# EAGLE design ChassisCab-samd21g (EAGLE 8.1.0)
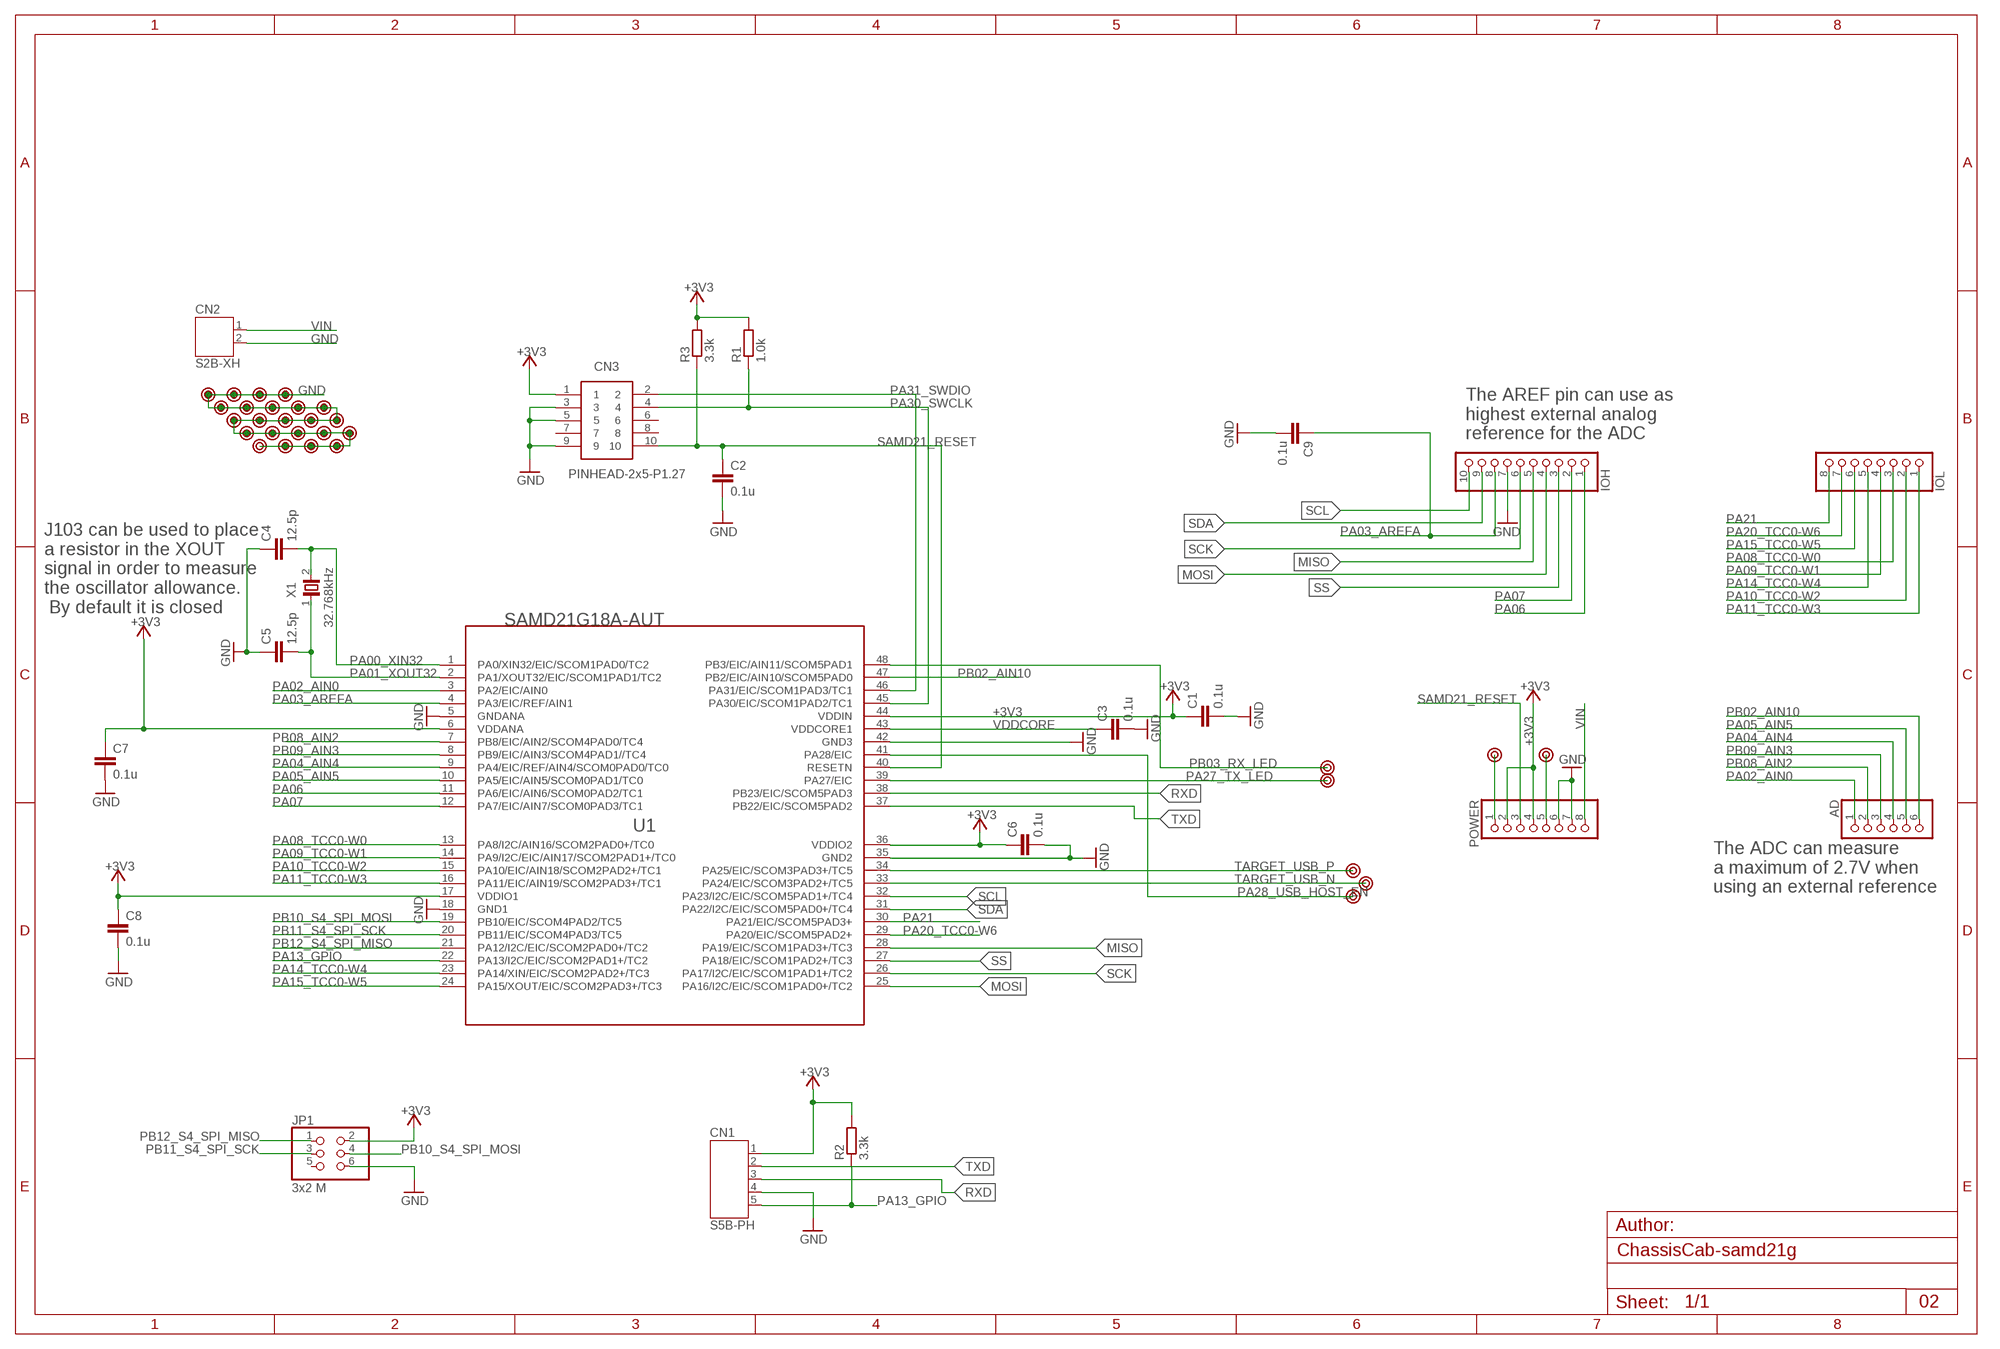
[diagram p0: schematic, sheet 1]

## Parts
AD  6x1F-H8.5  PINHD-1X6  [1X06]
C1  0.1u  C-EUC0603  [C0603]
C2  0.1u  C-EUC0603  [C0603]
C3  0.1u  C-EUC0603  [C0603]
C4  12.5p  C-EUC0603  [C0603]
C5  12.5p  C-EUC0603  [C0603]
C6  0.1u  C-EUC0603  [C0603]
C7  0.1u  C-EUC0603  [C0603]
C8  0.1u  C-EUC0603  [C0603]
C9  0.1u  C-EUC0603  [C0603]
CN1  S5B-PH  [S5B-PH]
CN2  S2B-XH  [S2B-XH]
CN3  PINHEAD-2x5-P1.27  SHF-105-01-X-D-SM  [SHF-105-01-X-D-SM]
IOH  10x1F-H8.5  PINHD-1X10_ARD  [1X10]
IOL  8x1F-H8.5  PINHD-1X8  [1X08]
JP1  3x2 M  PINHD-2X3  [2X03]
POWER  8x1F-H8.5  PINHD-1X8  [1X08]
R1  1.0k  R-EU_R0603  [R0603]
R2  3.3k  R-EU_R0603  [R0603]
R3  3.3k  R-EU_R0603  [R0603]
U1  SAMD21G18A-AUT  SAMD21G18A  [TQFP48]
U$1  PAD  [PAD]
U$2  PAD  [PAD]
U$3  PAD  [PAD]
U$4  PAD  [PAD]
U$6  PAD  [PAD]
U$7  PAD  [PAD]
U$8  PAD  [PAD]
U$9  PAD  [PAD]
U$10  PAD  [PAD]
U$11  PAD  [PAD]
U$12  PAD  [PAD]
U$13  PAD  [PAD]
U$14  PAD  [PAD]
U$15  PAD  [PAD]
U$16  PAD  [PAD]
U$17  PAD  [PAD]
U$18  PAD  [PAD]
U$19  PAD  [PAD]
U$20  PAD  [PAD]
U$21  PAD  [PAD]
U$22  PAD  [PAD]
U$23  PAD  [PAD]
U$24  PAD  [PAD]
U$25  PAD  [PAD]
U$26  PAD  [PAD]
U$27  PAD  [PAD]
U$28  PAD  [PAD]
U$29  PAD  [PAD]
U$30  PAD  [PAD]
U$31  PAD  [PAD]
X1  32.768kHz  FC-135  [FC-135]

## Nets
+3V3: C1.1 C6.1 C7.1 C8.1 CN1.1 CN3.1 JP1.2 POWER.2 POWER.4 R1.2 R2.2 R3.2 U1.6(VDDANA) U1.17(VDDIO1) U1.36(VDDIO2) U1.44(VDDIN)
GND [gnd]: C1.2 C2.2 C3.2 C4.1 C5.1 C6.2 C7.2 C8.2 C9.2 CN1.4 CN2.2 CN3.3 CN3.5 CN3.9 IOH.7 JP1.6 POWER.6 POWER.7 U1.5(GNDANA) U1.18(GND1) U1.35(GND2) U1.42(GND3) U$2.1 U$8.1 U$9.1 U$10.1 U$11.1 U$12.1 U$13.1 U$14.1 U$15.1 U$16.1 U$17.1 U$18.1 U$19.1 U$20.1 U$21.1 U$22.1 U$23.1 U$24.1 U$25.1 U$26.1 U$27.1 U$28.1 U$31.1
MISO: IOH.5 U1.28(PA19/EIC/SCOM1PAD3+/TC3)
MOSI: IOH.4 U1.25(PA16/I2C/EIC/SCOM1PAD0+/TC2)
N$1: POWER.1 U$29.1
N$2: POWER.5 U$30.1
PA00_XIN32: C4.2 U1.1(PA0/XIN32/EIC/SCOM1PAD0/TC2) X1.2
PA01_XOUT32: C5.2 U1.2(PA1/XOUT32/EIC/SCOM1PAD1/TC2) X1.1
PA02_AIN0: AD.1 U1.3(PA2/EIC/AIN0)
PA03_AREFA: C9.1 IOH.8 U1.4(PA3/EIC/REF/AIN1)
PA04_AIN4: AD.4 U1.9(PA4/EIC/REF/AIN4/SCOM0PAD0/TC0)
PA05_AIN5: AD.5 U1.10(PA5/EIC/AIN5/SCOM0PAD1/TC0)
PA06: IOH.1 U1.11(PA6/EIC/AIN6/SCOM0PAD2/TC1)
PA07: IOH.2 U1.12(PA7/EIC/AIN7/SCOM0PAD3/TC1)
PA08_TCC0-W0: IOL.3 U1.13(PA8/I2C/AIN16/SCOM2PAD0+/TC0)
PA09_TCC0-W1: IOL.4 U1.14(PA9/I2C/EIC/AIN17/SCOM2PAD1+/TC0)
PA10_TCC0-W2: IOL.2 U1.15(PA10/EIC/AIN18/SCOM2PAD2+/TC1)
PA11_TCC0-W3: IOL.1 U1.16(PA11/EIC/AIN19/SCOM2PAD3+/TC1)
PA13_GPIO: CN1.5 R2.1 U1.22(PA13/I2C/EIC/SCOM2PAD1+/TC2)
PA14_TCC0-W4: IOL.5 U1.23(PA14/XIN/EIC/SCOM2PAD2+/TC3)
PA15_TCC0-W5: IOL.6 U1.24(PA15/XOUT/EIC/SCOM2PAD3+/TC3)
PA20_TCC0-W6: IOL.7 U1.29(PA20/EIC/SCOM5PAD2+)
PA21: IOL.8 U1.30(PA21/EIC/SCOM5PAD3+)
PA27_TX_LED: U1.39(PA27/EIC) U$4.1
PA28_USB_HOST_EN: U1.41(PA28/EIC) U$3.1
PA30_SWCLK: CN3.4 R1.1 U1.45(PA30/EIC/SCOM1PAD2/TC1)
PA31_SWDIO: CN3.2 U1.46(PA31/EIC/SCOM1PAD3/TC1)
PB02_AIN10: AD.6 U1.47(PB2/EIC/AIN10/SCOM5PAD0)
PB03_RX_LED: U1.48(PB3/EIC/AIN11/SCOM5PAD1) U$1.1
PB08_AIN2: AD.2 U1.7(PB8/EIC/AIN2/SCOM4PAD0/TC4)
PB09_AIN3: AD.3 U1.8(PB9/EIC/AIN3/SCOM4PAD1//TC4)
PB10_S4_SPI_MOSI: JP1.4 U1.19(PB10/EIC/SCOM4PAD2/TC5)
PB11_S4_SPI_SCK: JP1.3 U1.20(PB11/EIC/SCOM4PAD3/TC5)
PB12_S4_SPI_MISO: JP1.1 U1.21(PA12/I2C/EIC/SCOM2PAD0+/TC2)
RXD: CN1.3 U1.38(PB23/EIC/SCOM5PAD3)
SAMD21_RESET: C2.1 CN3.10 POWER.3 R3.1 U1.40(RESETN)
SCK: IOH.6 U1.26(PA17/I2C/EIC/SCOM1PAD1+/TC2)
SCL: IOH.10 U1.32(PA23/I2C/EIC/SCOM5PAD1+/TC4)
SDA: IOH.9 U1.31(PA22/I2C/EIC/SCOM5PAD0+/TC4)
SS: IOH.3 U1.27(PA18/EIC/SCOM1PAD2+/TC3)
TARGET_USB_N [USBpair]: U1.33(PA24/EIC/SCOM3PAD2+/TC5) U$7.1
TARGET_USB_P [USBpair]: U1.34(PA25/EIC/SCOM3PAD3+/TC5) U$6.1
TXD: CN1.2 U1.37(PB22/EIC/SCOM5PAD2)
VDDCORE: C3.1 U1.43(VDDCORE1)
VIN: CN2.1 POWER.8
Unconnected: CN3.6 CN3.7 CN3.8 JP1.5

## Notes on the sheet
- The AREF pin can use as
  highest external analog
  reference for the ADC
- J103 can be used to place
  a resistor in the XOUT 
  signal in order to measure 
  the oscillator allowance.
   By default it is closed
- The ADC can measure 
  a maximum of 2.7V when
  using an external reference
- 02

## Library data of the parts
AD = arduino:PINHD-1X6: PIN HEADER
C1-C9 = rcl:C-EU: CAPACITOR, European symbol
CN1 = jst:S5B-PH
CN2 = jst:S2B-XH
CN3 = samtec:SHF-105-01-X-D-SM: 0.050"X0.050" SHROUDED TERMINAL STRIP ASSEMBLY, 10PINS.
IOH = arduino:PINHD-1X10_ARD: PIN HEADER
IOL POWER = arduino:PINHD-1X8: PIN HEADER
JP1 = arduino:PINHD-2X3: PIN HEADER
R1-R3 = rcl:R-EU_: RESISTOR, European symbol
U1 = atmel:SAMD21G18A: Atmel D21 32bit ARM Cortex-M0 microcontroller - 48 PIN TQFP 256KB flash memory + 32KB SRAM
U$1-U$4 U$6-U$31 = Misc:PAD
X1 = epson:FC-135

## Net classes
0 default: width 0.102 mm, drill 0.1 mm
1 USB: width 0.102 mm, drill 0.1 mm
2 gnd: width 0.102 mm, drill 0.1 mm
3 usbvcc: width 0.102 mm, drill 0.1 mm, clearance 0.15 mm
4 USBpair: width 0.102 mm, drill 0.1 mm, clearance 0.15 mm to class 3

## Board
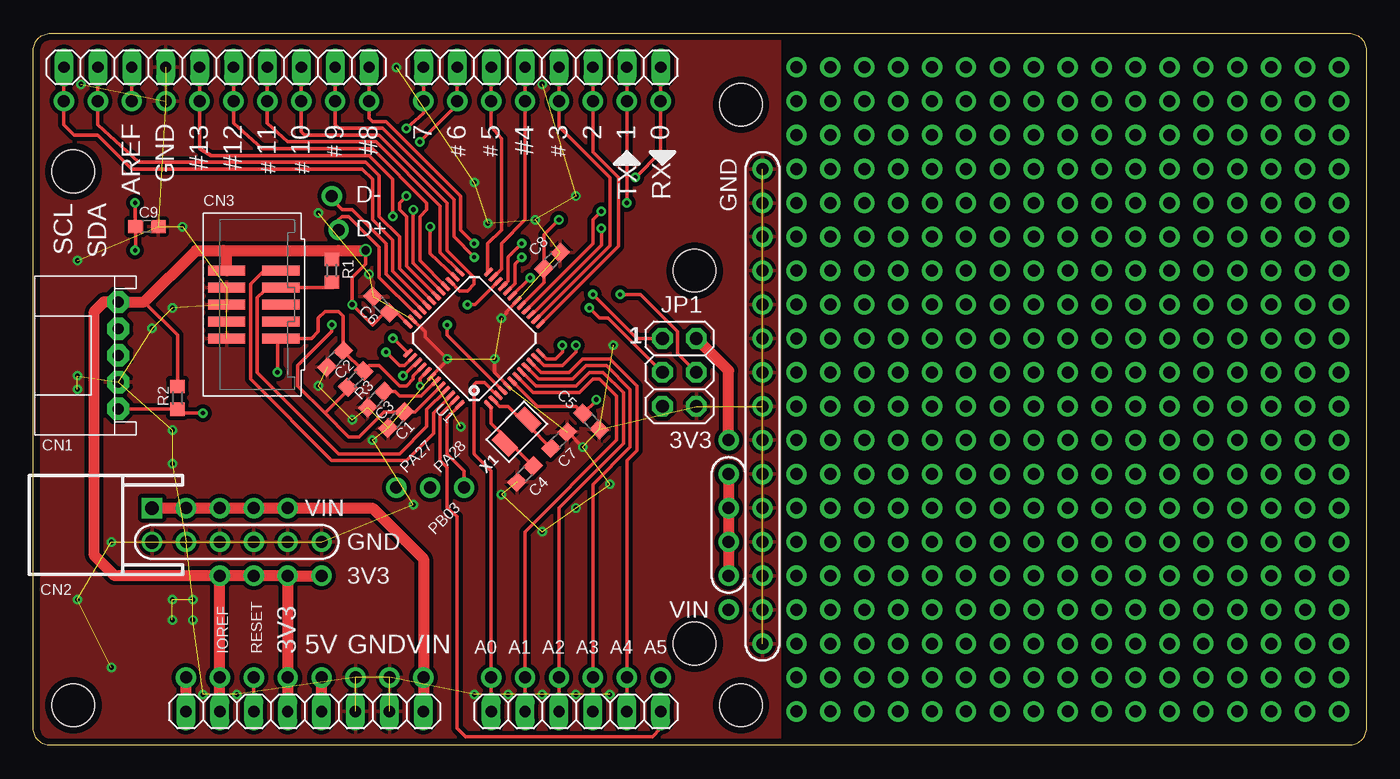
[diagram p1: board, top side]
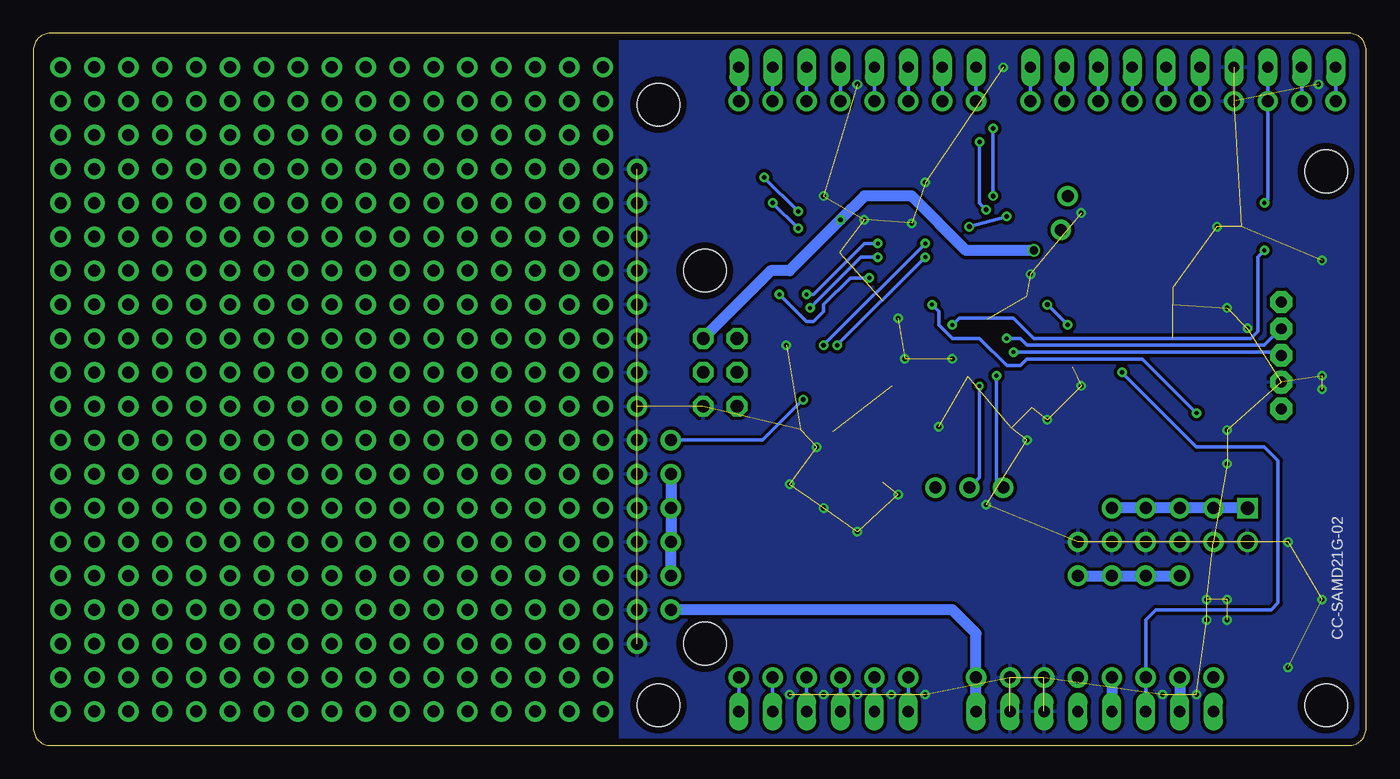
[diagram p2: board, bottom side, seen from below]

Size 99.82 x 53.34 mm. Coordinates in mm from the lower left corner, seen from the top.
Outline: 98.55,53.34 arc-90 99.82,52.07 99.82,1.27 arc-90 98.55,0 1.27,0 arc-90 0,1.27 0,52.07 arc-90 1.27,53.34 98.55,53.34
Copper layers (1*16): Top 0.035mm / dielectric 1.6mm / Bottom 0.035mm
Design rules "Elecrow_2-layer_PCB_eagle_rule": minimum track width 6mil, minimum drill 12mil, track to track 6mil, track to pad 6mil, pad to pad 6mil, via to via 8mil, smd to smd 0mil, copper to edge 20mil, drill to drill 10mil, minimum pad ring 6mil, minimum via ring 6mil, stop-mask expansion 0mil, vias tented up to drill 100mil, thermal gap 10mil
Holes 3.2 mm at 49.53,35.56 49.53,7.62 3,43 3,3 53,3 53,48
tKeepout: 1 lines

### Footprints (pad centres in the part's own frame; a part is rotated, then mirrored left to right if it is on the bottom)
1X06 = drill 0.85 pad 1.422 long: 1 -6.35,0; 2 -3.81,0; 3 -1.27,0; 4 1.27,0; 5 3.81,0; 6 6.35,0
C0603 = smd 1.1 x 1: 1 -0.85,0; 2 0.85,0
S5B-PH = drill 0.813 pad 1.676 octagon: 1 -4,0; 2 -2,0; 3 0,0; 4 2,0; 5 4,0
S2B-XH = drill 1.016 square: 1 -1.27,0 | drill 1.016: 2 1.27,0
SHF-105-01-X-D-SM = smd 0.737 x 2.794: 1 -2.54,-2.032; 2 -2.54,2.032; 3 -1.27,-2.032; 4 -1.27,2.032; 5 0,-2.032; 6 0,2.032; 7 1.27,-2.032; 8 1.27,2.032; 9 2.54,-2.032; 10 2.54,2.032
1X10 = drill 0.85 pad 1.422 long: 1 -11.43,0; 2 -8.89,0; 3 -6.35,0; 4 -3.81,0; 5 -1.27,0; 6 1.27,0; 7 3.81,0; 8 6.35,0; 9 8.89,0; 10 11.43,0
1X08 = drill 0.85 pad 1.422 long: 1 -8.89,0; 2 -6.35,0; 3 -3.81,0; 4 -1.27,0; 5 1.27,0; 6 3.81,0; 7 6.35,0; 8 8.89,0
2X03 = drill 0.95 pad 1.55 octagon: 1 -2.54,-1.27; 2 -2.54,1.27; 3 0,-1.27; 4 0,1.27; 5 2.54,-1.27; 6 2.54,1.27
R0603 = smd 1 x 1.1: 1 -0.85,0; 2 0.85,0
TQFP48 = smd 0.85 x 0.32: 1 -4.275,2.75; 2 -4.275,2.25; 3 -4.275,1.75; 4 -4.275,1.25; 5 -4.275,0.75; 6 -4.275,0.25; 7 -4.275,-0.25; 8 -4.275,-0.75; 9 -4.275,-1.25; 10 -4.275,-1.75; 11 -4.275,-2.25; 12 -4.275,-2.75; 25 4.275,-2.75; 26 4.275,-2.25; 27 4.275,-1.75; 28 4.275,-1.25; 29 4.275,-0.75; 30 4.275,-0.25; 31 4.275,0.25; 32 4.275,0.75; 33 4.275,1.25; 34 4.275,1.75; 35 4.275,2.25; 36 4.275,2.75 | smd 0.32 x 0.85: 13 -2.75,-4.275; 14 -2.25,-4.275; 15 -1.75,-4.275; 16 -1.25,-4.275; 17 -0.75,-4.275; 18 -0.25,-4.275; 19 0.25,-4.275; 20 0.75,-4.275; 21 1.25,-4.275; 22 1.75,-4.275; 23 2.25,-4.275; 24 2.75,-4.275; 37 2.75,4.275; 38 2.25,4.275; 39 1.75,4.275; 40 1.25,4.275; 41 0.75,4.275; 42 0.25,4.275; 43 -0.25,4.275; 44 -0.75,4.275; 45 -1.25,4.275; 46 -1.75,4.275; 47 -2.25,4.275; 48 -2.75,4.275
PAD = drill 0.9 pad 1.524: 1 0,0
FC-135 = smd 1 x 1.8: 1 -1.25,0; 2 1.25,0

### Placement (x,y rotation side)
AD  40.64,2.54 0 top
C1  27.18,24.38 225 top
C2  22.61,28.96 225 top
C3  25.65,25.91 225 top
C4  36.83,20.32 45 top
C5  39.37,22.86 225 top
C6  26.04,33.02 135 top
C7  41.78,24.26 315 top
C8  38.86,36.32 45 top
C9  8.51,38.86 0 top
CN1  6.35,29.21 270 top
CN2  8.89,16.51 270 top
CN3  16.51,33.02 270 top
IOH  13.72,50.8 180 top
IOL  38.1,50.8 180 top
JP1  48.39,27.94 270 top
POWER  20.32,2.54 0 top
R1  22.35,35.56 90 top
R2  10.79,26.04 90 top
R3  24.13,27.43 225 top
U1  33.02,30.48 135 top
U$1  32.26,19.3 0 top
U$2  11.43,15.24 0 top
U$3  29.72,19.3 0 top
U$4  27.18,19.3 0 top
U$6  22.86,38.61 0 top
U$7  22.35,41.15 0 top
U$8  16.51,15.24 0 top
U$9  19.05,15.24 0 top
U$10  13.97,15.24 0 top
U$11  54.61,33.02 0 top
U$12  54.61,38.1 0 top
U$13  54.61,25.4 0 top
U$14  54.61,22.86 0 top
U$15  54.61,20.32 0 top
U$16  54.61,12.7 0 top
U$17  26.67,5.08 0 top
U$18  54.61,43.18 0 top
U$19  54.61,7.62 0 top
U$20  54.61,40.64 0 top
U$21  54.61,35.56 0 top
U$22  24.13,5.08 0 top
U$23  54.61,10.16 0 top
U$24  54.61,15.24 0 top
U$25  54.61,17.78 0 top
U$26  54.61,30.48 0 top
U$27  54.61,27.94 0 top
U$28  9.91,48.26 0 top
U$29  11.43,5.08 0 top
U$30  21.59,5.08 0 top
U$31  21.59,15.24 0 top
X1  36.2,23.5 225 top

### Tracks (layer width: path | path; a pad name or v marks a point on that pad's centre or on a via)
+3V3  (via drill 0.35 pad 0.71, 0.6, 0.9 pad 1.52)
  Top 0.254: U1.36 27.19,32.42 C6.1 26.32,32.42 25.4,31.5 v23.88,33.02 23.88,35.05 24.89,36.07 v24.89,37.08 | U1.44 28.59,24.98 C1.1 26.25,24.98 24.38,23.11 23.62,23.11 21.84,24.89 | C7.1 | C7.1 40.64,25.4 37.75,25.4 U1.6 | U1.17 38.26,34.66 C8.1 38.26,38.26 v39.37,39.37 | R2.2 10.79,30.73 8.32,33.21 | R1.2 22.86,37.08 | 21.84,24.89 19.81,26.92 19.81,28.45 22.35,30.99 v22.35,31.5 | v42.16,25.91 42.16,25.84 C7.1 | R3.2 23.53,26.58 21.84,24.89
  Top 0.813: 14.22,37.08 12.19,37.08 8.32,33.21 CN1.1 5.27,33.21 4.57,32.51 4.57,14.22 6.1,12.7 v13.97,12.7 | 14.22,37.08 22.86,37.08 v24.89,37.08 | CN3.1 14.48,36.83 14.22,37.08 | v19.05,12.7 v21.59,12.7 | v19.05,12.7 v16.51,12.7 v13.97,12.7 | POWER.2 v13.97,12.7 | v19.05,12.7 POWER.4 | v52.07,22.86 52.07,28.07 JP1.2
  Bottom 0.254: v22.35,31.5 v23.88,33.02 | JP1.2 49.78,30.48 | v52.07,22.86 45.21,22.86 v42.16,25.91
  Bottom 0.813: v24.89,37.08 29.97,37.08 34.04,41.15 37.59,41.15 v39.37,39.37 43.18,35.56 44.58,35.56 JP1.2 | v19.05,5.08 POWER.4 | v13.97,5.08 POWER.2 | v21.59,12.7 v13.97,12.7
GND  (via drill 0.35 pad 0.71)  (84 unrouted)
  Top 0.254: C5.1 40.04,23.46 v41.15,22.35 | U1.42 29.82,27.66 30.99,28.83 v30.99,28.96 29.34,30.61 29.34,30.99 U1.35 | U1.5 35.51,26.97 34.54,27.94 v34.54,28.96 | U1.18 36.22,33.3 35.43,32.51 35.43,32.38 v35.05,32
  other vias: 35.05,18.8 25.4,22.86 23.88,24.38 21.34,26.92 35.56,3.81 38.1,3.81 40.64,3.81 43.18,3.81 38.1,16 40.64,17.78 43.18,19.56 40.64,41.15 34.04,39.12 33.02,42.16 21.34,39.88 11.18,38.86 12.7,3.81 15.24,3.81 8.89,31.24 3.3,27.69 3.3,26.67 10.41,32.77 25.15,35.31 32,23.88 33.02,3.81 43.43,29.97 28.45,18.03 10.41,23.62 10.41,21.08 5.84,15.24 5.84,5.84 10.41,9.4 10.41,10.92 11.94,10.92 11.94,9.4 3.56,49.53 38.1,49.53 27.18,50.8 37.59,39.37 3.3,36.32 3.3,10.92
  pour Bottom (isolate 0.254, rank 2): -2.54,55.88 55.88,55.88 55.88,-2.54 -2.54,-2.54
  pour Top (isolate 0.305, rank 2): -1.27,54.61 55.88,54.61 55.88,-1.27 -1.27,-1.27
MISO  (via drill 0.9 pad 1.52)
  Top 0.254: IOH.5 14.99,46.61 17.14,44.7 25.4,44.7 29.46,40.64 29.46,40.13 28.96,39.62 28.96,36.31 U1.28
  Bottom 0.254: v14.99,48.26 IOH.5
MOSI  (via drill 0.9 pad 1.52)
  Top 0.254: IOH.4 17.53,46.61 19.05,45.21 25.65,45.21 30.48,40.39 30.48,36.91 U1.25
  Bottom 0.254: v17.53,48.26 IOH.4
N$1
  Top 0.813: POWER.1 U$29.1
N$2
  Top 0.813: POWER.5 U$30.1
N$3  (via drill 0.9 pad 1.52)
  other vias: 57.15,50.8
N$4  (via drill 0.9 pad 1.52)
  other vias: 57.15,48.26
N$5  (via drill 0.9 pad 1.52)
  other vias: 57.15,45.72
N$6  (via drill 0.9 pad 1.52)
  other vias: 57.15,43.18
N$7  (via drill 0.9 pad 1.52)
  other vias: 57.15,40.64
N$8  (via drill 0.9 pad 1.52)
  other vias: 57.15,38.1
N$9  (via drill 0.9 pad 1.52)
  other vias: 57.15,35.56
N$10  (via drill 0.9 pad 1.52)
  other vias: 57.15,33.02
N$11  (via drill 0.9 pad 1.52)
  other vias: 57.15,30.48
N$12  (via drill 0.9 pad 1.52)
  other vias: 57.15,27.94
N$13  (via drill 0.9 pad 1.52)
  other vias: 57.15,25.4
N$14  (via drill 0.9 pad 1.52)
  other vias: 57.15,22.86
N$15  (via drill 0.9 pad 1.52)
  other vias: 57.15,20.32
N$16  (via drill 0.9 pad 1.52)
  other vias: 57.15,17.78
N$17  (via drill 0.9 pad 1.52)
  other vias: 57.15,15.24
N$18  (via drill 0.9 pad 1.52)
  other vias: 57.15,12.7
N$19  (via drill 0.9 pad 1.52)
  other vias: 57.15,10.16
N$20  (via drill 0.9 pad 1.52)
  other vias: 57.15,7.62
N$21  (via drill 0.9 pad 1.52)
  other vias: 57.15,5.08
N$22  (via drill 0.9 pad 1.52)
  other vias: 57.15,2.54
N$23  (via drill 0.9 pad 1.52)
  other vias: 59.69,50.8
N$24  (via drill 0.9 pad 1.52)
  other vias: 59.69,48.26
N$25  (via drill 0.9 pad 1.52)
  other vias: 59.69,45.72
N$26  (via drill 0.9 pad 1.52)
  other vias: 59.69,43.18
N$27  (via drill 0.9 pad 1.52)
  other vias: 59.69,40.64
N$28  (via drill 0.9 pad 1.52)
  other vias: 59.69,38.1
N$29  (via drill 0.9 pad 1.52)
  other vias: 59.69,35.56
N$30  (via drill 0.9 pad 1.52)
  other vias: 59.69,33.02
N$31  (via drill 0.9 pad 1.52)
  other vias: 59.69,30.48
N$32  (via drill 0.9 pad 1.52)
  other vias: 59.69,27.94
N$33  (via drill 0.9 pad 1.52)
  other vias: 59.69,25.4
N$34  (via drill 0.9 pad 1.52)
  other vias: 59.69,22.86
N$35  (via drill 0.9 pad 1.52)
  other vias: 59.69,20.32
N$36  (via drill 0.9 pad 1.52)
  other vias: 59.69,17.78
N$37  (via drill 0.9 pad 1.52)
  other vias: 59.69,15.24
N$38  (via drill 0.9 pad 1.52)
  other vias: 59.69,12.7
N$39  (via drill 0.9 pad 1.52)
  other vias: 59.69,10.16
N$40  (via drill 0.9 pad 1.52)
  other vias: 59.69,7.62
N$41  (via drill 0.9 pad 1.52)
  other vias: 59.69,5.08
N$42  (via drill 0.9 pad 1.52)
  other vias: 59.69,2.54
N$43  (via drill 0.9 pad 1.52)
  other vias: 62.23,50.8
N$44  (via drill 0.9 pad 1.52)
  other vias: 62.23,48.26
N$45  (via drill 0.9 pad 1.52)
  other vias: 62.23,45.72
N$46  (via drill 0.9 pad 1.52)
  other vias: 62.23,43.18
N$47  (via drill 0.9 pad 1.52)
  other vias: 62.23,40.64
N$48  (via drill 0.9 pad 1.52)
  other vias: 62.23,38.1
N$49  (via drill 0.9 pad 1.52)
  other vias: 62.23,35.56
N$50  (via drill 0.9 pad 1.52)
  other vias: 62.23,33.02
N$51  (via drill 0.9 pad 1.52)
  other vias: 62.23,30.48
N$52  (via drill 0.9 pad 1.52)
  other vias: 62.23,27.94
N$53  (via drill 0.9 pad 1.52)
  other vias: 62.23,25.4
N$54  (via drill 0.9 pad 1.52)
  other vias: 62.23,22.86
N$55  (via drill 0.9 pad 1.52)
  other vias: 62.23,20.32
N$56  (via drill 0.9 pad 1.52)
  other vias: 62.23,17.78
N$57  (via drill 0.9 pad 1.52)
  other vias: 62.23,15.24
N$58  (via drill 0.9 pad 1.52)
  other vias: 62.23,12.7
N$59  (via drill 0.9 pad 1.52)
  other vias: 62.23,10.16
N$60  (via drill 0.9 pad 1.52)
  other vias: 62.23,7.62
N$61  (via drill 0.9 pad 1.52)
  other vias: 62.23,5.08
N$62  (via drill 0.9 pad 1.52)
  other vias: 62.23,2.54
N$63  (via drill 0.9 pad 1.52)
  other vias: 64.77,50.8
N$64  (via drill 0.9 pad 1.52)
  other vias: 64.77,48.26
N$65  (via drill 0.9 pad 1.52)
  other vias: 64.77,45.72
N$66  (via drill 0.9 pad 1.52)
  other vias: 64.77,43.18
N$67  (via drill 0.9 pad 1.52)
  other vias: 64.77,40.64
N$68  (via drill 0.9 pad 1.52)
  other vias: 64.77,38.1
N$69  (via drill 0.9 pad 1.52)
  other vias: 64.77,35.56
N$70  (via drill 0.9 pad 1.52)
  other vias: 64.77,33.02
N$71  (via drill 0.9 pad 1.52)
  other vias: 64.77,30.48
N$72  (via drill 0.9 pad 1.52)
  other vias: 64.77,27.94
N$73  (via drill 0.9 pad 1.52)
  other vias: 64.77,25.4
N$74  (via drill 0.9 pad 1.52)
  other vias: 64.77,22.86
N$75  (via drill 0.9 pad 1.52)
  other vias: 64.77,20.32
N$76  (via drill 0.9 pad 1.52)
  other vias: 64.77,17.78
N$77  (via drill 0.9 pad 1.52)
  other vias: 64.77,15.24
N$78  (via drill 0.9 pad 1.52)
  other vias: 64.77,12.7
N$79  (via drill 0.9 pad 1.52)
  other vias: 64.77,10.16
N$80  (via drill 0.9 pad 1.52)
  other vias: 64.77,7.62
N$81  (via drill 0.9 pad 1.52)
  other vias: 64.77,5.08
N$82  (via drill 0.9 pad 1.52)
  other vias: 64.77,2.54
N$83  (via drill 0.9 pad 1.52)
  other vias: 67.31,50.8
N$84  (via drill 0.9 pad 1.52)
  other vias: 67.31,48.26
N$85  (via drill 0.9 pad 1.52)
  other vias: 67.31,45.72
N$86  (via drill 0.9 pad 1.52)
  other vias: 67.31,43.18
N$87  (via drill 0.9 pad 1.52)
  other vias: 67.31,40.64
N$88  (via drill 0.9 pad 1.52)
  other vias: 67.31,38.1
N$89  (via drill 0.9 pad 1.52)
  other vias: 67.31,35.56
N$90  (via drill 0.9 pad 1.52)
  other vias: 67.31,33.02
N$91  (via drill 0.9 pad 1.52)
  other vias: 67.31,30.48
N$92  (via drill 0.9 pad 1.52)
  other vias: 67.31,27.94
N$93  (via drill 0.9 pad 1.52)
  other vias: 67.31,25.4
N$94  (via drill 0.9 pad 1.52)
  other vias: 67.31,22.86
N$95  (via drill 0.9 pad 1.52)
  other vias: 67.31,20.32
N$96  (via drill 0.9 pad 1.52)
  other vias: 67.31,17.78
N$97  (via drill 0.9 pad 1.52)
  other vias: 67.31,15.24
N$98  (via drill 0.9 pad 1.52)
  other vias: 67.31,12.7
N$99  (via drill 0.9 pad 1.52)
  other vias: 67.31,10.16
N$100  (via drill 0.9 pad 1.52)
  other vias: 67.31,7.62
N$101  (via drill 0.9 pad 1.52)
  other vias: 67.31,5.08
N$102  (via drill 0.9 pad 1.52)
  other vias: 67.31,2.54
N$103  (via drill 0.9 pad 1.52)
  other vias: 69.85,50.8
N$104  (via drill 0.9 pad 1.52)
  other vias: 69.85,48.26
N$105  (via drill 0.9 pad 1.52)
  other vias: 69.85,45.72
N$106  (via drill 0.9 pad 1.52)
  other vias: 69.85,43.18
N$107  (via drill 0.9 pad 1.52)
  other vias: 69.85,40.64
N$108  (via drill 0.9 pad 1.52)
  other vias: 69.85,38.1
N$109  (via drill 0.9 pad 1.52)
  other vias: 69.85,35.56
N$110  (via drill 0.9 pad 1.52)
  other vias: 69.85,33.02
N$111  (via drill 0.9 pad 1.52)
  other vias: 69.85,30.48
N$112  (via drill 0.9 pad 1.52)
  other vias: 69.85,27.94
N$113  (via drill 0.9 pad 1.52)
  other vias: 69.85,25.4
N$114  (via drill 0.9 pad 1.52)
  other vias: 69.85,22.86
N$115  (via drill 0.9 pad 1.52)
  other vias: 69.85,20.32
N$116  (via drill 0.9 pad 1.52)
  other vias: 69.85,17.78
N$117  (via drill 0.9 pad 1.52)
  other vias: 69.85,15.24
N$118  (via drill 0.9 pad 1.52)
  other vias: 69.85,12.7
N$119  (via drill 0.9 pad 1.52)
  other vias: 69.85,10.16
N$120  (via drill 0.9 pad 1.52)
  other vias: 69.85,7.62
N$121  (via drill 0.9 pad 1.52)
  other vias: 69.85,5.08
N$122  (via drill 0.9 pad 1.52)
  other vias: 69.85,2.54
N$123  (via drill 0.9 pad 1.52)
  other vias: 72.39,50.8
N$124  (via drill 0.9 pad 1.52)
  other vias: 72.39,48.26
N$125  (via drill 0.9 pad 1.52)
  other vias: 72.39,45.72
N$126  (via drill 0.9 pad 1.52)
  other vias: 72.39,43.18
N$127  (via drill 0.9 pad 1.52)
  other vias: 72.39,40.64
N$128  (via drill 0.9 pad 1.52)
  other vias: 72.39,38.1
N$129  (via drill 0.9 pad 1.52)
  other vias: 72.39,35.56
N$130  (via drill 0.9 pad 1.52)
  other vias: 72.39,33.02
N$131  (via drill 0.9 pad 1.52)
  other vias: 72.39,30.48
N$132  (via drill 0.9 pad 1.52)
  other vias: 72.39,27.94
N$133  (via drill 0.9 pad 1.52)
  other vias: 72.39,25.4
N$134  (via drill 0.9 pad 1.52)
  other vias: 72.39,22.86
N$135  (via drill 0.9 pad 1.52)
  other vias: 72.39,20.32
N$136  (via drill 0.9 pad 1.52)
  other vias: 72.39,17.78
N$137  (via drill 0.9 pad 1.52)
  other vias: 72.39,15.24
N$138  (via drill 0.9 pad 1.52)
  other vias: 72.39,12.7
N$139  (via drill 0.9 pad 1.52)
  other vias: 72.39,10.16
N$140  (via drill 0.9 pad 1.52)
  other vias: 72.39,7.62
N$141  (via drill 0.9 pad 1.52)
  other vias: 72.39,5.08
N$142  (via drill 0.9 pad 1.52)
  other vias: 72.39,2.54
N$143  (via drill 0.9 pad 1.52)
  other vias: 74.93,50.8
N$144  (via drill 0.9 pad 1.52)
  other vias: 74.93,48.26
N$145  (via drill 0.9 pad 1.52)
  other vias: 74.93,45.72
N$146  (via drill 0.9 pad 1.52)
  other vias: 74.93,43.18
N$147  (via drill 0.9 pad 1.52)
  other vias: 74.93,40.64
N$148  (via drill 0.9 pad 1.52)
  other vias: 74.93,38.1
N$149  (via drill 0.9 pad 1.52)
  other vias: 74.93,35.56
N$150  (via drill 0.9 pad 1.52)
  other vias: 74.93,33.02
N$151  (via drill 0.9 pad 1.52)
  other vias: 74.93,30.48
N$152  (via drill 0.9 pad 1.52)
  other vias: 74.93,27.94
N$153  (via drill 0.9 pad 1.52)
  other vias: 74.93,25.4
N$154  (via drill 0.9 pad 1.52)
  other vias: 74.93,22.86
N$155  (via drill 0.9 pad 1.52)
  other vias: 74.93,20.32
N$156  (via drill 0.9 pad 1.52)
  other vias: 74.93,17.78
N$157  (via drill 0.9 pad 1.52)
  other vias: 74.93,15.24
N$158  (via drill 0.9 pad 1.52)
  other vias: 74.93,12.7
N$159  (via drill 0.9 pad 1.52)
  other vias: 74.93,10.16
N$160  (via drill 0.9 pad 1.52)
  other vias: 74.93,7.62
N$161  (via drill 0.9 pad 1.52)
  other vias: 74.93,5.08
N$162  (via drill 0.9 pad 1.52)
  other vias: 74.93,2.54
N$163  (via drill 0.9 pad 1.52)
  other vias: 77.47,50.8
N$164  (via drill 0.9 pad 1.52)
  other vias: 77.47,48.26
N$165  (via drill 0.9 pad 1.52)
  other vias: 77.47,45.72
N$166  (via drill 0.9 pad 1.52)
  other vias: 77.47,43.18
N$167  (via drill 0.9 pad 1.52)
  other vias: 77.47,40.64
N$168  (via drill 0.9 pad 1.52)
  other vias: 77.47,38.1
N$169  (via drill 0.9 pad 1.52)
  other vias: 77.47,35.56
N$170  (via drill 0.9 pad 1.52)
  other vias: 77.47,33.02
N$171  (via drill 0.9 pad 1.52)
  other vias: 77.47,30.48
N$172  (via drill 0.9 pad 1.52)
  other vias: 77.47,27.94
N$173  (via drill 0.9 pad 1.52)
  other vias: 77.47,25.4
N$174  (via drill 0.9 pad 1.52)
  other vias: 77.47,22.86
N$175  (via drill 0.9 pad 1.52)
  other vias: 77.47,20.32
N$176  (via drill 0.9 pad 1.52)
  other vias: 77.47,17.78
N$177  (via drill 0.9 pad 1.52)
  other vias: 77.47,15.24
N$178  (via drill 0.9 pad 1.52)
  other vias: 77.47,12.7
N$179  (via drill 0.9 pad 1.52)
  other vias: 77.47,10.16
N$180  (via drill 0.9 pad 1.52)
  other vias: 77.47,7.62
N$181  (via drill 0.9 pad 1.52)
  other vias: 77.47,5.08
N$182  (via drill 0.9 pad 1.52)
  other vias: 77.47,2.54
N$183  (via drill 0.9 pad 1.52)
  other vias: 80.01,50.8
N$184  (via drill 0.9 pad 1.52)
  other vias: 80.01,48.26
N$185  (via drill 0.9 pad 1.52)
  other vias: 80.01,45.72
N$186  (via drill 0.9 pad 1.52)
  other vias: 80.01,43.18
N$187  (via drill 0.9 pad 1.52)
  other vias: 80.01,40.64
N$188  (via drill 0.9 pad 1.52)
  other vias: 80.01,38.1
N$189  (via drill 0.9 pad 1.52)
  other vias: 80.01,35.56
N$190  (via drill 0.9 pad 1.52)
  other vias: 80.01,33.02
N$191  (via drill 0.9 pad 1.52)
  other vias: 80.01,30.48
N$192  (via drill 0.9 pad 1.52)
  other vias: 80.01,27.94
N$193  (via drill 0.9 pad 1.52)
  other vias: 80.01,25.4
N$194  (via drill 0.9 pad 1.52)
  other vias: 80.01,22.86
N$195  (via drill 0.9 pad 1.52)
  other vias: 80.01,20.32
N$196  (via drill 0.9 pad 1.52)
  other vias: 80.01,17.78
N$197  (via drill 0.9 pad 1.52)
  other vias: 80.01,15.24
N$198  (via drill 0.9 pad 1.52)
  other vias: 80.01,12.7
N$199  (via drill 0.9 pad 1.52)
  other vias: 80.01,10.16
N$200  (via drill 0.9 pad 1.52)
  other vias: 80.01,7.62
N$201  (via drill 0.9 pad 1.52)
  other vias: 80.01,5.08
N$202  (via drill 0.9 pad 1.52)
  other vias: 80.01,2.54
N$203  (via drill 0.9 pad 1.52)
  other vias: 82.55,50.8
N$204  (via drill 0.9 pad 1.52)
  other vias: 82.55,48.26
N$205  (via drill 0.9 pad 1.52)
  other vias: 82.55,45.72
N$206  (via drill 0.9 pad 1.52)
  other vias: 82.55,43.18
N$207  (via drill 0.9 pad 1.52)
  other vias: 82.55,40.64
N$208  (via drill 0.9 pad 1.52)
  other vias: 82.55,38.1
N$209  (via drill 0.9 pad 1.52)
  other vias: 82.55,35.56
N$210  (via drill 0.9 pad 1.52)
  other vias: 82.55,33.02
N$211  (via drill 0.9 pad 1.52)
  other vias: 82.55,30.48
N$212  (via drill 0.9 pad 1.52)
  other vias: 82.55,27.94
N$213  (via drill 0.9 pad 1.52)
  other vias: 82.55,25.4
N$214  (via drill 0.9 pad 1.52)
  other vias: 82.55,22.86
N$215  (via drill 0.9 pad 1.52)
  other vias: 82.55,20.32
N$216  (via drill 0.9 pad 1.52)
  other vias: 82.55,17.78
N$217  (via drill 0.9 pad 1.52)
  other vias: 82.55,15.24
N$218  (via drill 0.9 pad 1.52)
  other vias: 82.55,12.7
N$219  (via drill 0.9 pad 1.52)
  other vias: 82.55,10.16
N$220  (via drill 0.9 pad 1.52)
  other vias: 82.55,7.62
N$221  (via drill 0.9 pad 1.52)
  other vias: 82.55,5.08
N$222  (via drill 0.9 pad 1.52)
  other vias: 82.55,2.54
N$223  (via drill 0.9 pad 1.52)
  other vias: 85.09,50.8
N$224  (via drill 0.9 pad 1.52)
  other vias: 85.09,48.26
N$225  (via drill 0.9 pad 1.52)
  other vias: 85.09,45.72
N$226  (via drill 0.9 pad 1.52)
  other vias: 85.09,43.18
N$227  (via drill 0.9 pad 1.52)
  other vias: 85.09,40.64
N$228  (via drill 0.9 pad 1.52)
  other vias: 85.09,38.1
N$229  (via drill 0.9 pad 1.52)
  other vias: 85.09,35.56
N$230  (via drill 0.9 pad 1.52)
  other vias: 85.09,33.02
N$231  (via drill 0.9 pad 1.52)
  other vias: 85.09,30.48
N$232  (via drill 0.9 pad 1.52)
  other vias: 85.09,27.94
N$233  (via drill 0.9 pad 1.52)
  other vias: 85.09,25.4
N$234  (via drill 0.9 pad 1.52)
  other vias: 85.09,22.86
N$235  (via drill 0.9 pad 1.52)
  other vias: 85.09,20.32
N$236  (via drill 0.9 pad 1.52)
  other vias: 85.09,17.78
N$237  (via drill 0.9 pad 1.52)
  other vias: 85.09,15.24
N$238  (via drill 0.9 pad 1.52)
  other vias: 85.09,12.7
N$239  (via drill 0.9 pad 1.52)
  other vias: 85.09,10.16
N$240  (via drill 0.9 pad 1.52)
  other vias: 85.09,7.62
N$241  (via drill 0.9 pad 1.52)
  other vias: 85.09,5.08
N$242  (via drill 0.9 pad 1.52)
  other vias: 85.09,2.54
N$243  (via drill 0.9 pad 1.52)
  other vias: 87.63,50.8
N$244  (via drill 0.9 pad 1.52)
  other vias: 87.63,48.26
N$245  (via drill 0.9 pad 1.52)
  other vias: 87.63,45.72
N$246  (via drill 0.9 pad 1.52)
  other vias: 87.63,43.18
N$247  (via drill 0.9 pad 1.52)
  other vias: 87.63,40.64
N$248  (via drill 0.9 pad 1.52)
  other vias: 87.63,38.1
N$249  (via drill 0.9 pad 1.52)
  other vias: 87.63,35.56
N$250  (via drill 0.9 pad 1.52)
  other vias: 87.63,33.02
N$251  (via drill 0.9 pad 1.52)
  other vias: 87.63,30.48
N$252  (via drill 0.9 pad 1.52)
  other vias: 87.63,27.94
N$253  (via drill 0.9 pad 1.52)
  other vias: 87.63,25.4
N$254  (via drill 0.9 pad 1.52)
  other vias: 87.63,22.86
N$255  (via drill 0.9 pad 1.52)
  other vias: 87.63,20.32
N$256  (via drill 0.9 pad 1.52)
  other vias: 87.63,17.78
N$257  (via drill 0.9 pad 1.52)
  other vias: 87.63,15.24
N$258  (via drill 0.9 pad 1.52)
  other vias: 87.63,12.7
N$259  (via drill 0.9 pad 1.52)
  other vias: 87.63,10.16
N$260  (via drill 0.9 pad 1.52)
  other vias: 87.63,7.62
N$261  (via drill 0.9 pad 1.52)
  other vias: 87.63,5.08
N$262  (via drill 0.9 pad 1.52)
  other vias: 87.63,2.54
N$263  (via drill 0.9 pad 1.52)
  other vias: 90.17,50.8
N$264  (via drill 0.9 pad 1.52)
  other vias: 90.17,48.26
N$265  (via drill 0.9 pad 1.52)
  other vias: 90.17,45.72
N$266  (via drill 0.9 pad 1.52)
  other vias: 90.17,43.18
N$267  (via drill 0.9 pad 1.52)
  other vias: 90.17,40.64
N$268  (via drill 0.9 pad 1.52)
  other vias: 90.17,38.1
N$269  (via drill 0.9 pad 1.52)
  other vias: 90.17,35.56
N$270  (via drill 0.9 pad 1.52)
  other vias: 90.17,33.02
N$271  (via drill 0.9 pad 1.52)
  other vias: 90.17,30.48
N$272  (via drill 0.9 pad 1.52)
  other vias: 90.17,27.94
N$273  (via drill 0.9 pad 1.52)
  other vias: 90.17,25.4
N$274  (via drill 0.9 pad 1.52)
  other vias: 90.17,22.86
N$275  (via drill 0.9 pad 1.52)
  other vias: 90.17,20.32
N$276  (via drill 0.9 pad 1.52)
  other vias: 90.17,17.78
N$277  (via drill 0.9 pad 1.52)
  other vias: 90.17,15.24
N$278  (via drill 0.9 pad 1.52)
  other vias: 90.17,12.7
N$279  (via drill 0.9 pad 1.52)
  other vias: 90.17,10.16
N$280  (via drill 0.9 pad 1.52)
  other vias: 90.17,7.62
N$281  (via drill 0.9 pad 1.52)
  other vias: 90.17,5.08
N$282  (via drill 0.9 pad 1.52)
  other vias: 90.17,2.54
N$283  (via drill 0.9 pad 1.52)
  other vias: 92.71,50.8
N$284  (via drill 0.9 pad 1.52)
  other vias: 92.71,48.26
N$285  (via drill 0.9 pad 1.52)
  other vias: 92.71,45.72
N$286  (via drill 0.9 pad 1.52)
  other vias: 92.71,43.18
N$287  (via drill 0.9 pad 1.52)
  other vias: 92.71,40.64
N$288  (via drill 0.9 pad 1.52)
  other vias: 92.71,38.1
N$289  (via drill 0.9 pad 1.52)
  other vias: 92.71,35.56
N$290  (via drill 0.9 pad 1.52)
  other vias: 92.71,33.02
N$291  (via drill 0.9 pad 1.52)
  other vias: 92.71,30.48
N$292  (via drill 0.9 pad 1.52)
  other vias: 92.71,27.94
N$293  (via drill 0.9 pad 1.52)
  other vias: 92.71,25.4
N$294  (via drill 0.9 pad 1.52)
  other vias: 92.71,22.86
N$295  (via drill 0.9 pad 1.52)
  other vias: 92.71,20.32
N$296  (via drill 0.9 pad 1.52)
  other vias: 92.71,17.78
N$297  (via drill 0.9 pad 1.52)
  other vias: 92.71,15.24
N$298  (via drill 0.9 pad 1.52)
  other vias: 92.71,12.7
N$299  (via drill 0.9 pad 1.52)
  other vias: 92.71,10.16
N$300  (via drill 0.9 pad 1.52)
  other vias: 92.71,7.62
N$301  (via drill 0.9 pad 1.52)
  other vias: 92.71,5.08
N$302  (via drill 0.9 pad 1.52)
  other vias: 92.71,2.54
N$303  (via drill 0.9 pad 1.52)
  other vias: 95.25,50.8
N$304  (via drill 0.9 pad 1.52)
  other vias: 95.25,48.26
N$305  (via drill 0.9 pad 1.52)
  other vias: 95.25,45.72
N$306  (via drill 0.9 pad 1.52)
  other vias: 95.25,43.18
N$307  (via drill 0.9 pad 1.52)
  other vias: 95.25,40.64
N$308  (via drill 0.9 pad 1.52)
  other vias: 95.25,38.1
N$309  (via drill 0.9 pad 1.52)
  other vias: 95.25,35.56
N$310  (via drill 0.9 pad 1.52)
  other vias: 95.25,33.02
N$311  (via drill 0.9 pad 1.52)
  other vias: 95.25,30.48
N$312  (via drill 0.9 pad 1.52)
  other vias: 95.25,27.94
N$313  (via drill 0.9 pad 1.52)
  other vias: 95.25,25.4
N$314  (via drill 0.9 pad 1.52)
  other vias: 95.25,22.86
N$315  (via drill 0.9 pad 1.52)
  other vias: 95.25,20.32
N$316  (via drill 0.9 pad 1.52)
  other vias: 95.25,17.78
N$317  (via drill 0.9 pad 1.52)
  other vias: 95.25,15.24
N$318  (via drill 0.9 pad 1.52)
  other vias: 95.25,12.7
N$319  (via drill 0.9 pad 1.52)
  other vias: 95.25,10.16
N$320  (via drill 0.9 pad 1.52)
  other vias: 95.25,7.62
N$321  (via drill 0.9 pad 1.52)
  other vias: 95.25,5.08
N$322  (via drill 0.9 pad 1.52)
  other vias: 95.25,2.54
N$323  (via drill 0.9 pad 1.52)
  other vias: 97.79,50.8
N$324  (via drill 0.9 pad 1.52)
  other vias: 97.79,48.26
N$325  (via drill 0.9 pad 1.52)
  other vias: 97.79,45.72
N$326  (via drill 0.9 pad 1.52)
  other vias: 97.79,43.18
N$327  (via drill 0.9 pad 1.52)
  other vias: 97.79,40.64
N$328  (via drill 0.9 pad 1.52)
  other vias: 97.79,38.1
N$329  (via drill 0.9 pad 1.52)
  other vias: 97.79,35.56
N$330  (via drill 0.9 pad 1.52)
  other vias: 97.79,33.02
N$331  (via drill 0.9 pad 1.52)
  other vias: 97.79,30.48
N$332  (via drill 0.9 pad 1.52)
  other vias: 97.79,27.94
N$333  (via drill 0.9 pad 1.52)
  other vias: 97.79,25.4
N$334  (via drill 0.9 pad 1.52)
  other vias: 97.79,22.86
N$335  (via drill 0.9 pad 1.52)
  other vias: 97.79,20.32
N$336  (via drill 0.9 pad 1.52)
  other vias: 97.79,17.78
N$337  (via drill 0.9 pad 1.52)
  other vias: 97.79,15.24
N$338  (via drill 0.9 pad 1.52)
  other vias: 97.79,12.7
N$339  (via drill 0.9 pad 1.52)
  other vias: 97.79,10.16
N$340  (via drill 0.9 pad 1.52)
  other vias: 97.79,7.62
N$341  (via drill 0.9 pad 1.52)
  other vias: 97.79,5.08
N$342  (via drill 0.9 pad 1.52)
  other vias: 97.79,2.54
N$900  (via drill 0.9 pad 1.52)
  Top 0.813: v52.07,20.32 v52.07,12.7
  Bottom 0.813: v52.07,20.32 v52.07,17.78 v52.07,15.24 v52.07,12.7
PA00_XIN32
  Top 0.254: U1.1 34.29,25.32 34.29,24.13 35.31,23.11 X1.2 35.74,22.61 C4.2
PA01_XOUT32
  Top 0.254: U1.2 34.92,25.4 35.56,25.4 36.58,24.38 X1.1 37.08,23.95 C5.2
PA02_AIN0  (via drill 0.9 pad 1.52)
  Top 0.254: U1.3 34.74,26.22 33.78,27.18 33.15,27.18 33.02,27.05 33.02,21.84 34.29,20.57 AD.1
  Bottom 0.254: v34.29,5.08 AD.1
PA03_AREFA  (via drill 0.3 pad 0.71, 0.9 pad 1.52)
  Top 0.254: v7.62,40.64 7.62,38.9 C9.1 7.66,37.12 v7.62,37.08 | v30.99,31.5 30.99,30.74 U1.4 | IOH.8 v7.37,48.26
  Bottom 0.254: IOH.8 7.37,40.89 v7.62,40.64 | v7.62,37.08 8.13,36.58 8.13,30.99 8.64,30.48 24.89,30.48 26.42,32 30.48,32 v30.99,31.5
PA04_AIN4  (via drill 0.9 pad 1.52)
  Top 0.254: U1.9 37.84,27.43 40.39,27.43 41.4,28.45 42.93,28.45 44.7,26.67 44.7,22.35 41.91,19.56 AD.4
  Bottom 0.254: v41.91,5.08 AD.4
PA05_AIN5  (via drill 0.9 pad 1.52)
  Top 0.254: 37.28,28.63 U1.10 38.03,27.94 40.13,27.94 41.15,28.96 43.18,28.96 45.21,26.92 45.21,22.1 44.45,21.34 AD.5
  Bottom 0.254: v44.45,5.08 AD.5
PA06  (via drill 0.3 pad 0.71, 0.35 pad 0.71, 0.9 pad 1.52)
  Top 0.254: U1.11 38.23,28.45 39.62,28.45 40.64,29.46 v40.64,29.97 | IOH.1 25.15,46.99 25.4,46.74 26.42,46.74 32,41.15 32,38.61 v33.02,37.59
  Bottom 0.254: v40.64,29.97 v33.02,37.59 | v25.15,48.26 IOH.1
PA07  (via drill 0.3 pad 0.71, 0.35 pad 0.71, 0.9 pad 1.52)
  Top 0.254: 38.03,29.4 U1.12 38.43,28.96 39.12,28.96 39.62,29.46 v39.62,29.97 | IOH.2 22.61,46.48 22.86,46.23 26.16,46.23 31.5,40.89 31.5,38.1 v33.02,36.58
  Bottom 0.254: v39.62,29.97 v33.02,36.58 | v22.61,48.26 IOH.2
PA08_TCC0-W0  (via drill 0.9 pad 1.52)
  Top 0.254: IOL.3 41.91,44.45 43.81,42.55 43.81,37.39 U1.13
  Bottom 0.254: IOL.3 v41.91,48.26
PA09_TCC0-W1  (via drill 0.9 pad 1.52)
  Top 0.254: IOL.4 39.37,46.35 43.18,42.55 43.18,37.46 U1.14
  Bottom 0.254: v39.37,48.26 IOL.4
PA10_TCC0-W2  (via drill 0.35 pad 0.71, 0.9 pad 1.52)
  Top 0.254: U1.15 37.34,32.27 42.55,37.47 v42.55,38.73 | v44.45,40.64 IOL.2
  Bottom 0.254: v42.55,38.73 v44.45,40.64 | IOL.2 v44.45,48.26
PA11_TCC0-W3  (via drill 0.35 pad 0.71, 0.9 pad 1.52)
  Top 0.254: U1.16 41.91,37.6 41.91,39.37 v42.55,40.01 | v45.09,42.55 46.99,44.45 IOL.1
  Bottom 0.254: v42.55,40.01 v45.09,42.55 | IOL.1 v46.99,48.26
PA13_GPIO  (via drill 0.3 pad 0.71)
  Top 0.254: 34.74,34.74 U1.22 33.09,33.02 v32.51,33.02 | v12.7,24.89 11.09,24.89 R2.1 6.38,25.18 CN1.5
  Bottom 0.254: v12.7,24.89 16.76,28.96 25.4,28.96 25.91,28.45 26.92,28.45 28.96,30.48 30.99,30.48 32,31.5 32,32.51 v32.51,33.02
PA14_TCC0-W4  (via drill 0.9 pad 1.52)
  Top 0.254: IOL.5 36.83,39.37 35.05,37.59 35.05,35.69 U1.23
  Bottom 0.254: v36.83,48.26 IOL.5
PA15_TCC0-W5  (via drill 0.9 pad 1.52)
  Top 0.254: IOL.6 34.29,46.35 35.05,45.47 35.05,38.61 34.04,37.59 34.04,35.51 U1.24
  Bottom 0.254: v34.29,48.26 IOL.6
PA20_TCC0-W6  (via drill 0.35 pad 0.71, 0.9 pad 1.52)
  Top 0.254: v28.45,40.13 28.45,36.11 U1.29 | v28.96,45.21 31.75,48.01 IOL.7
  Bottom 0.254: v28.45,40.13 28.96,40.64 v28.96,45.21 | v31.75,48.26 IOL.7
PA21  (via drill 0.35 pad 0.71, 0.9 pad 1.52)
  Top 0.254: U1.30 27.94,35.91 27.94,39.62 27.43,40.13 27.43,40.64 v27.94,41.15 | v27.94,46.23 29.21,47.37 IOL.8
  Bottom 0.254: v27.94,41.15 v27.94,46.23 | v29.21,48.26 IOL.8
PA27_TX_LED  (via drill 0.3 pad 0.71)
  Top 0.254: U1.39 28.7,28.7 v27.69,27.69
  Bottom 0.254: v27.69,27.69 27.69,19.81 U$4.1
PA28_USB_HOST_EN  (via drill 0.3 pad 0.61)
  Top 0.254: v28.96,26.92 28.96,27.48 U1.41
  Bottom 0.254: v28.96,26.92 28.96,20.07 U$3.1
PA30_SWCLK
  Top 0.254: R1.1 22.44,34.29 CN3.4 18.29,34.04 17.27,34.04 16.76,33.53 16.76,27.94 22.86,21.84 27.43,21.84 29.46,23.88 29.46,25.15 U1.45
PA31_SWDIO
  Top 0.254: U1.46 31.23,26.16 29.97,24.89 29.97,23.37 27.94,21.34 22.35,21.34 16.26,27.43 16.26,34.54 17.27,35.56 CN3.2
PB02_AIN10  (via drill 0.9 pad 1.52)
  Top 0.254: U1.47 30.48,24.77 30.48,21.34 30.99,20.83 30.99,17.78 31.75,17.14 31.75,1.27 32.38,0.64 46.35,0.64 46.99,1.27 AD.6
  Bottom 0.254: v46.99,5.08 AD.6
PB03_RX_LED
  Top 0.254: U$1.1 32.26,20.57 30.99,21.84 30.99,24.56 U1.48
PB08_AIN2  (via drill 0.9 pad 1.52)
  Top 0.254: 36.25,27.63 U1.7 37.44,26.42 40.89,26.42 41.91,27.43 42.42,27.43 43.69,26.16 43.69,22.86 36.83,16 AD.2
  Bottom 0.254: v36.83,5.08 AD.2
PB09_AIN3  (via drill 0.9 pad 1.52)
  Top 0.254: 36.57,27.94 U1.8 37.64,26.92 40.64,26.92 41.66,27.94 42.67,27.94 44.2,26.42 44.2,22.61 39.37,17.78 AD.3
  Bottom 0.254: v39.37,5.08 AD.3
PB10_S4_SPI_MOSI  (via drill 0.3 pad 0.71)
  Top 0.254: v37.21,35.02 U1.19 | v43.94,33.78 45.47,33.78 48.26,30.99 48.26,29.34 JP1.4
  Bottom 0.254: v37.21,35.02 38.63,35.02 40.64,33.02 40.64,32.51 41.4,31.75 41.91,31.75 v43.94,33.78
PB11_S4_SPI_SCK  (via drill 0.3 pad 0.71)
  Top 0.254: v36.58,36.58 36.07,36.07 36.07,34.59 U1.20 | v41.66,32.77 42.42,32 43.05,32 JP1.3
  Bottom 0.254: v36.58,36.58 37.85,36.58 v41.66,32.77
PB12_S4_SPI_MISO  (via drill 0.3 pad 0.71)
  Top 0.254: v36.58,37.59 35.56,36.58 35.56,34.79 U1.21 | JP1.1 45.21,30.48 v41.91,33.78
  Bottom 0.254: v36.58,37.59 37.59,37.59 41.4,33.78 v41.91,33.78
RXD  (via drill 0.3 pad 0.71)
  Top 0.254: v26.42,29.46 27.43,28.45 27.81,28.45 U1.38
  Bottom 0.254: v26.42,29.46 6.6,29.46 CN1.3
SAMD21_RESET  (via drill 0.35 pad 0.71, 0.9 pad 1.52)
  Top 0.254: U1.40 28.46,27.69 28.45,27.69 28.45,27.43 27.94,26.92 27.43,26.92 25.91,28.45 25.15,28.45 R3.1 C2.1 23.21,32.16 22.86,32.51 21.84,32.51 21.34,32 21.34,30.99 20.83,30.48 CN3.10 18.29,30.23 v18.29,27.94 | v16.51,5.08 POWER.3
  Bottom 0.254: POWER.3 16.51,9.4 15.75,10.16 7.11,10.16 6.6,10.67 6.6,21.34 7.62,22.35 12.7,22.35 v18.29,27.94
SCK  (via drill 0.35 pad 0.71, 0.9 pad 1.52)
  Top 0.254: U1.26 29.72,36.84 v29.72,38.86 | v26.92,39.62 26.92,42.42 25.15,44.2 13.34,44.2 12.45,44.7 IOH.6
  Bottom 0.254: v29.72,38.86 v26.92,39.62 | v12.45,48.26 IOH.6
SCL  (via drill 0.9 pad 1.52)
  Top 0.254: IOH.10 2.29,46.48 3.05,45.72 4.83,45.72 7.37,43.18 24.64,43.18 25.4,42.42 25.4,39.37 26.92,37.85 26.92,35.52 U1.32
  Bottom 0.254: v2.29,48.26 IOH.10
SDA  (via drill 0.9 pad 1.52)
  Top 0.254: IOH.9 4.83,46.48 7.87,43.69 24.89,43.69 25.91,42.67 25.91,39.62 27.43,38.1 27.43,35.71 U1.31
  Bottom 0.254: v4.83,48.26 IOH.9
SS  (via drill 0.9 pad 1.52)
  Top 0.254: 31.3,34.74 U1.27 31.94,34.04 32.51,34.04 33.02,34.54 33.02,35.05 30.99,37.08 30.99,40.64 25.91,45.72 20.32,45.72 20.07,45.97 IOH.3
  Bottom 0.254: v20.07,48.26 IOH.3
TARGET_USB_N
  Top 0.152: 28.19,33.53 28.2,33.53 | 29.21,32.51 U1.33
  Top 0.254: U$7.1 22.86,40.39 23.11,40.13 23.88,40.13 26.42,37.59 26.42,35.31 28.19,33.53 29.21,32.51
TARGET_USB_P
  Top 0.152: 28.7,32.26 U1.34
  Top 0.254: U$6.1 22.86,39.37 23.11,39.62 23.62,39.62 25.91,37.34 25.91,35.05 28.7,32.26
TXD  (via drill 0.3 pad 0.71)
  Top 0.254: v26.92,30.48 26.97,30.48 U1.37
  Bottom 0.254: v26.92,30.48 25.91,30.48 25.4,29.97 7.62,29.97 6.38,31.21 CN1.2
VDDCORE
  Top 0.254: C3.1 27.09,26.51 27.43,26.16 29.06,26.16 U1.43
VIN  (via drill 0.9 pad 1.52)
  Top 0.813: CN2.1 25.4,17.78 29.21,13.97 POWER.8
  Bottom 0.813: v52.07,10.16 30.99,10.16 29.21,8.38 v29.21,5.08 POWER.8 | CN2.1 v11.43,17.78 v13.97,17.78 v16.51,17.78 v19.05,17.78

### Text on the board
tPlace: #13 | #12 | 11 | 10 | 9 | #8 | 7 | 6 | 5 | #4 | 3 | 2 | 1 | 0 | D- | GND | D+ | 3V3 | PA27 | PA28 | PB03 | VIN | GND | 3V3 | VIN
bPlace: CC-SAMD21G-02
tNames: AREF | GND | # | # | # | # | # | # | SCL | SDA | TX | RX | 1 | IOREF | RESET | 3V3 | 5V | GND | VIN | A0 | A1 | A2 | A3 | A4 | A5
214bmp: D:/SmartProjects/Snc/a4_bn_logo2.bmp